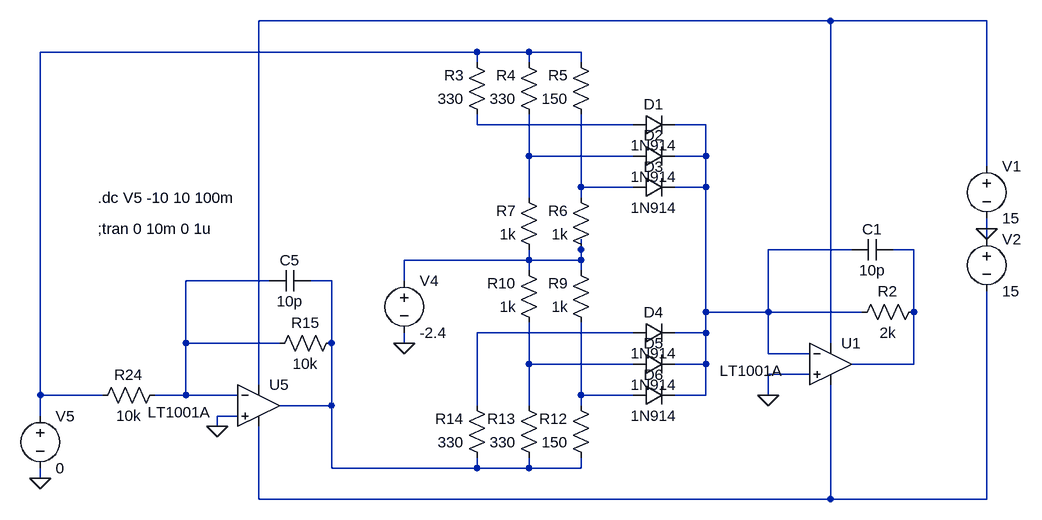
[diagram p0: schematic Parabola.asc]
Parabola.asc, the LTspice schematic file:
Version 4
SHEET 1 3400 680
WIRE 2160 -192 1280 -192
WIRE 2400 -192 2160 -192
WIRE 1616 -144 944 -144
WIRE 1696 -144 1616 -144
WIRE 1776 -144 1696 -144
WIRE 1616 -128 1616 -144
WIRE 1696 -128 1696 -144
WIRE 1776 -128 1776 -144
WIRE 1616 -32 1616 -48
WIRE 1856 -32 1616 -32
WIRE 1968 -32 1920 -32
WIRE 1696 16 1696 -48
WIRE 1856 16 1696 16
WIRE 1968 16 1968 -32
WIRE 1968 16 1920 16
WIRE 2400 32 2400 -192
WIRE 1776 64 1776 -48
WIRE 1856 64 1776 64
WIRE 1968 64 1968 16
WIRE 1968 64 1920 64
WIRE 1696 80 1696 16
WIRE 1776 80 1776 64
WIRE 2400 128 2400 112
WIRE 2400 144 2400 128
WIRE 1776 160 1776 144
WIRE 2192 160 2064 160
WIRE 2288 160 2256 160
WIRE 1696 176 1696 160
WIRE 1696 176 1504 176
WIRE 1776 176 1776 160
WIRE 1776 176 1696 176
WIRE 1696 192 1696 176
WIRE 1776 192 1776 176
WIRE 1296 208 1168 208
WIRE 1392 208 1360 208
WIRE 1504 208 1504 176
WIRE 1968 256 1968 64
WIRE 2064 256 2064 160
WIRE 2064 256 1968 256
WIRE 2208 256 2064 256
WIRE 2288 256 2288 160
WIRE 1856 288 1616 288
WIRE 1968 288 1968 256
WIRE 1968 288 1920 288
WIRE 1168 304 1168 208
WIRE 1312 304 1168 304
WIRE 1392 304 1392 208
WIRE 1504 304 1504 288
WIRE 2160 304 2160 -192
WIRE 2064 320 2064 256
WIRE 2128 320 2064 320
WIRE 1696 336 1696 272
WIRE 1856 336 1696 336
WIRE 1968 336 1968 288
WIRE 1968 336 1920 336
WIRE 2288 336 2288 256
WIRE 2288 336 2192 336
WIRE 2128 352 2064 352
WIRE 1280 368 1280 -192
WIRE 944 384 944 -144
WIRE 1040 384 944 384
WIRE 1168 384 1168 304
WIRE 1168 384 1120 384
WIRE 1248 384 1168 384
WIRE 1776 384 1776 272
WIRE 1856 384 1776 384
WIRE 1968 384 1968 336
WIRE 1968 384 1920 384
WIRE 2064 384 2064 352
WIRE 1392 400 1392 304
WIRE 1392 400 1312 400
WIRE 1616 400 1616 288
WIRE 1696 400 1696 336
WIRE 1776 400 1776 384
WIRE 944 416 944 384
WIRE 1248 416 1216 416
WIRE 1216 432 1216 416
WIRE 1392 496 1392 400
WIRE 1616 496 1616 480
WIRE 1616 496 1392 496
WIRE 1696 496 1696 480
WIRE 1696 496 1616 496
WIRE 1776 496 1776 480
WIRE 1776 496 1696 496
WIRE 944 512 944 496
WIRE 1280 544 1280 432
WIRE 2160 544 2160 368
WIRE 2160 544 1280 544
WIRE 2400 544 2400 224
WIRE 2400 544 2160 544
FLAG 2400 128 0
FLAG 1216 432 0
FLAG 2064 384 0
FLAG 1504 304 0
FLAG 944 512 0
SYMBOL voltage 2400 16 R0
WINDOW 123 0 0 Left 2
WINDOW 39 0 0 Left 2
SYMATTR InstName V1
SYMATTR Value 15
SYMBOL voltage 2400 128 R0
WINDOW 123 0 0 Left 2
WINDOW 39 0 0 Left 2
SYMATTR InstName V2
SYMATTR Value 15
SYMBOL Opamps\\LT1001A 2160 272 R0
WINDOW 3 -171 74 Left 2
SYMATTR InstName U1
SYMBOL Opamps\\LT1001A 1280 336 R0
WINDOW 3 -171 74 Left 2
SYMATTR InstName U5
SYMBOL res 1408 288 R90
WINDOW 0 0 56 VBottom 2
WINDOW 3 32 56 VTop 2
SYMATTR InstName R15
SYMATTR Value 10k
SYMBOL res 1136 368 R90
WINDOW 0 0 56 VBottom 2
WINDOW 3 32 56 VTop 2
SYMATTR InstName R24
SYMATTR Value 10k
SYMBOL cap 1360 192 R90
WINDOW 0 0 32 VBottom 2
WINDOW 3 32 32 VTop 2
SYMATTR InstName C5
SYMATTR Value 10p
SYMBOL diode 1856 -16 R270
WINDOW 0 32 32 VTop 2
WINDOW 3 0 32 VBottom 2
SYMATTR InstName D1
SYMATTR Value 1N914
SYMBOL res 2304 240 R90
WINDOW 0 0 56 VBottom 2
WINDOW 3 32 56 VTop 2
SYMATTR InstName R2
SYMATTR Value 2k
SYMBOL cap 2256 144 R90
WINDOW 0 0 32 VBottom 2
WINDOW 3 32 32 VTop 2
SYMATTR InstName C1
SYMATTR Value 10p
SYMBOL diode 1856 32 R270
WINDOW 0 32 32 VTop 2
WINDOW 3 0 32 VBottom 2
SYMATTR InstName D2
SYMATTR Value 1N914
SYMBOL diode 1856 80 R270
WINDOW 0 32 32 VTop 2
WINDOW 3 0 32 VBottom 2
SYMATTR InstName D3
SYMATTR Value 1N914
SYMBOL res 1632 -32 R180
WINDOW 0 36 76 Left 2
WINDOW 3 36 40 Left 2
SYMATTR InstName R3
SYMATTR Value 330
SYMBOL res 1712 -32 R180
WINDOW 0 36 76 Left 2
WINDOW 3 36 40 Left 2
SYMATTR InstName R4
SYMATTR Value 330
SYMBOL res 1792 -32 R180
WINDOW 0 36 76 Left 2
WINDOW 3 36 40 Left 2
SYMATTR InstName R5
SYMATTR Value 150
SYMBOL res 1792 176 R180
WINDOW 0 36 76 Left 2
WINDOW 3 36 40 Left 2
SYMATTR InstName R6
SYMATTR Value 1k
SYMBOL res 1712 176 R180
WINDOW 0 36 76 Left 2
WINDOW 3 36 40 Left 2
SYMATTR InstName R7
SYMATTR Value 1k
SYMBOL res 1792 288 R180
WINDOW 0 36 76 Left 2
WINDOW 3 36 40 Left 2
SYMATTR InstName R9
SYMATTR Value 1k
SYMBOL res 1712 288 R180
WINDOW 0 36 76 Left 2
WINDOW 3 36 40 Left 2
SYMATTR InstName R10
SYMATTR Value 1k
SYMBOL res 1792 496 R180
WINDOW 0 36 76 Left 2
WINDOW 3 36 40 Left 2
SYMATTR InstName R12
SYMATTR Value 150
SYMBOL res 1712 496 R180
WINDOW 0 36 76 Left 2
WINDOW 3 36 40 Left 2
SYMATTR InstName R13
SYMATTR Value 330
SYMBOL res 1632 496 R180
WINDOW 0 36 76 Left 2
WINDOW 3 36 40 Left 2
SYMATTR InstName R14
SYMATTR Value 330
SYMBOL diode 1856 304 R270
WINDOW 0 32 32 VTop 2
WINDOW 3 0 32 VBottom 2
SYMATTR InstName D4
SYMATTR Value 1N914
SYMBOL diode 1856 352 R270
WINDOW 0 32 32 VTop 2
WINDOW 3 0 32 VBottom 2
SYMATTR InstName D5
SYMATTR Value 1N914
SYMBOL diode 1856 400 R270
WINDOW 0 32 32 VTop 2
WINDOW 3 0 32 VBottom 2
SYMATTR InstName D6
SYMATTR Value 1N914
SYMBOL voltage 1504 192 R0
WINDOW 123 0 0 Left 2
WINDOW 39 0 0 Left 2
SYMATTR InstName V4
SYMATTR Value -2.4
SYMBOL voltage 944 400 R0
WINDOW 123 0 0 Left 2
WINDOW 39 0 0 Left 2
SYMATTR InstName V5
SYMATTR Value 0
TEXT 1032 80 Left 2 !.dc V5 -10 10 100m
TEXT 1032 128 Left 2 !;tran 0 10m 0 1u

The netlist it stands for:
* Parabola.asc
V1 N001 0 15
V2 0 N014 15
XU1 0 N004 N001 N014 N008 LT1001  ; LT1001A, pins In+ In- V+ V- OUT
XU5 0 N009 N001 N014 N010 LT1001  ; LT1001A, pins In+ In- V+ V- OUT
R15 N010 N009 10k
R24 N009 N002 10k
C5 N010 N009 10p
D1 N003 N004 1N914
R2 N008 N004 2k
C1 N008 N004 10p
D2 N005 N004 1N914
D3 N006 N004 1N914
R3 N003 N002 330
R4 N005 N002 330
R5 N006 N002 150
R6 N007 N006 1k
R7 N007 N005 1k
R9 N013 N007 1k
R10 N012 N007 1k
R12 N010 N013 150
R13 N010 N012 330
R14 N010 N011 330
D4 N011 N004 1N914
D5 N012 N004 1N914
D6 N013 N004 1N914
V4 N007 0 -2.4
V5 N002 0 0
.model D D
.lib standard.dio
.dc V5 -10 10 100m
;tran 0 10m 0 1u
.lib LTC.lib
.backanno
.end